# Altium project EL0258.PrjPcb
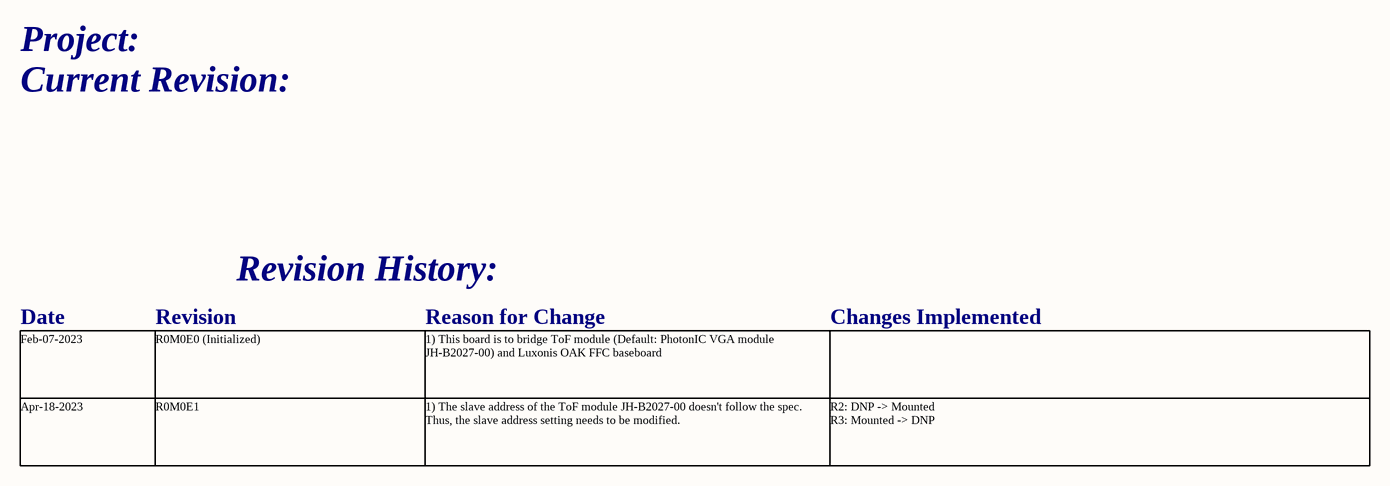
[diagram p0: 01_Project Information.SchDoc]
document_number: D0000999; drawn_by: Eason Lin; project_title: EL0258; revision: R0M0E1
3 sheets, 51 parts. Net scope: global (net labels, ports and power ports of the same name join across sheets).
Board file: EL0258.PcbDoc
Sheets:
  01_Project Information.SchDoc
  02_READ_ME.SchDoc
  03_TOF.SchDoc

## Sheet 01_Project Information.SchDoc: =project_title
size Tabloid; CompanyName: Luxonis Holding; DrawnBy: Eason Lin; Organization: Luxonis Holding; Address1: 1925 Harmony Park Drive; Address2: Westminster, CO; Address3: 80234; Address4: United States; DocumentNumber: D0000999; Revision: R0M0E1; SheetNumber: 1; SheetTotal: 3

### Notes on the sheet
- Project:
- Current Revision:
- Revision History:
- Date
- Revision
- Reason for Change
- Changes Implemented
- Feb-07-2023
- R0M0E0 (Initialized)
- 1) This board is to bridge ToF module (Default: PhotonIC VGA module JH-B2027-00) and Luxonis OAK FFC baseboard
- Apr-18-2023
- R0M0E1
- 1) The slave address of the ToF module JH-B2027-00 doesn't follow the spec. Thus, the slave address setting needs to be modified.
- R2: DNP -> Mounted
  R3: Mounted -> DNP
- Title
- Size:
- Date:
- Tabloid
- Number:
- Time:
- Revision:
- Sheet
- of
- Drawn by:

## Sheet 02_READ_ME.SchDoc: =project_title
size Tabloid; CompanyName: Luxonis Holding; DrawnBy: Eason Lin; Organization: Luxonis Holding; Address1: 1925 Harmony Park Drive; Address2: Westminster, CO; Address3: 80234; Address4: United States; DocumentNumber: D0000999; Revision: R0M0E1; SheetNumber: 1; SheetTotal: 3
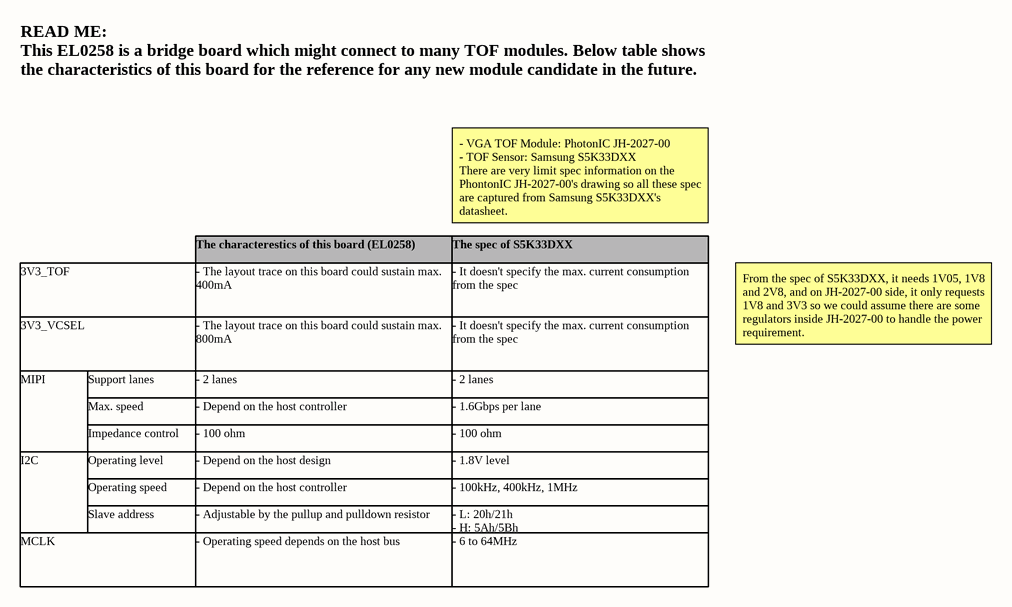
[diagram p1: 02_READ_ME.SchDoc]

### Notes on the sheet
- READ ME:
  This EL0258 is a bridge board which might connect to many TOF modules. Below table shows the characteristics of this board for the reference for any new module candidate in the future.
- - VGA TOF Module: PhotonIC JH-2027-00
  - TOF Sensor: Samsung S5K33DXX
  There are very limit spec information on the PhontonIC JH-2027-00's drawing so all these spec are captured from Samsung S5K33DXX's datasheet.
- 3V3_TOF
- - The layout trace on this board could sustain max. 400mA
- The characterestics of this board (EL0258)
- The spec of S5K33DXX
- - It doesn't specify the max. current consumption from the spec
- 3V3_VCSEL
- - The layout trace on this board could sustain max. 800mA
- From the spec of S5K33DXX, it needs 1V05, 1V8 and 2V8, and on JH-2027-00 side, it only requests 1V8 and 3V3 so we could assume there are some regulators inside JH-2027-00 to handle the power requirement.
- MIPI
- Support lanes
- Max. speed
- Impedance control
- - 2 lanes
- - Depend on the host controller
- - 100 ohm
- - 1.6Gbps per lane
- Operating level
- Operating speed
- - Depend on the host design
- - 1.8V level
- - 100kHz, 400kHz, 1MHz
- I2C
- MCLK
- Slave address
- - Adjustable by the pullup and pulldown resistor
- - Operating speed depends on the host bus
- - L: 20h/21h
  - H: 5Ah/5Bh
- - 6 to 64MHz
- Title
- Size:
- Date:
- Tabloid
- Number:
- Time:
- Revision:
- Sheet
- of
- Drawn by:

## Sheet 03_TOF.SchDoc: =project_title
size Tabloid; PageSetup: Record=PageOptions|CenterHorizontal=True|CenterVertical=True|PrintScale=0.71|XCorrection=1.00|YCorrection=1.00|PrintKind=0|BorderSize=5000000|LeftOffset=0|BottomOffset=0|Orientation=2|PaperLength=1000|PaperWidth=1000|Scale=100|PaperSource=7|PrintQuality=-4|MediaType=1|DitherType=10|PrintScaleMode=1|PaperKind=A4; CompanyName: Luxonis Holding; DrawnBy: Eason Lin; Organization: Luxonis Holding; Address1: 1925 Harmony Park Drive; Address2: Westminster, CO; Address3: 80234; Address4: United States; DocumentNumber: D0000999; Revision: R0M0E1; SheetNumber: 3; SheetTotal: 3
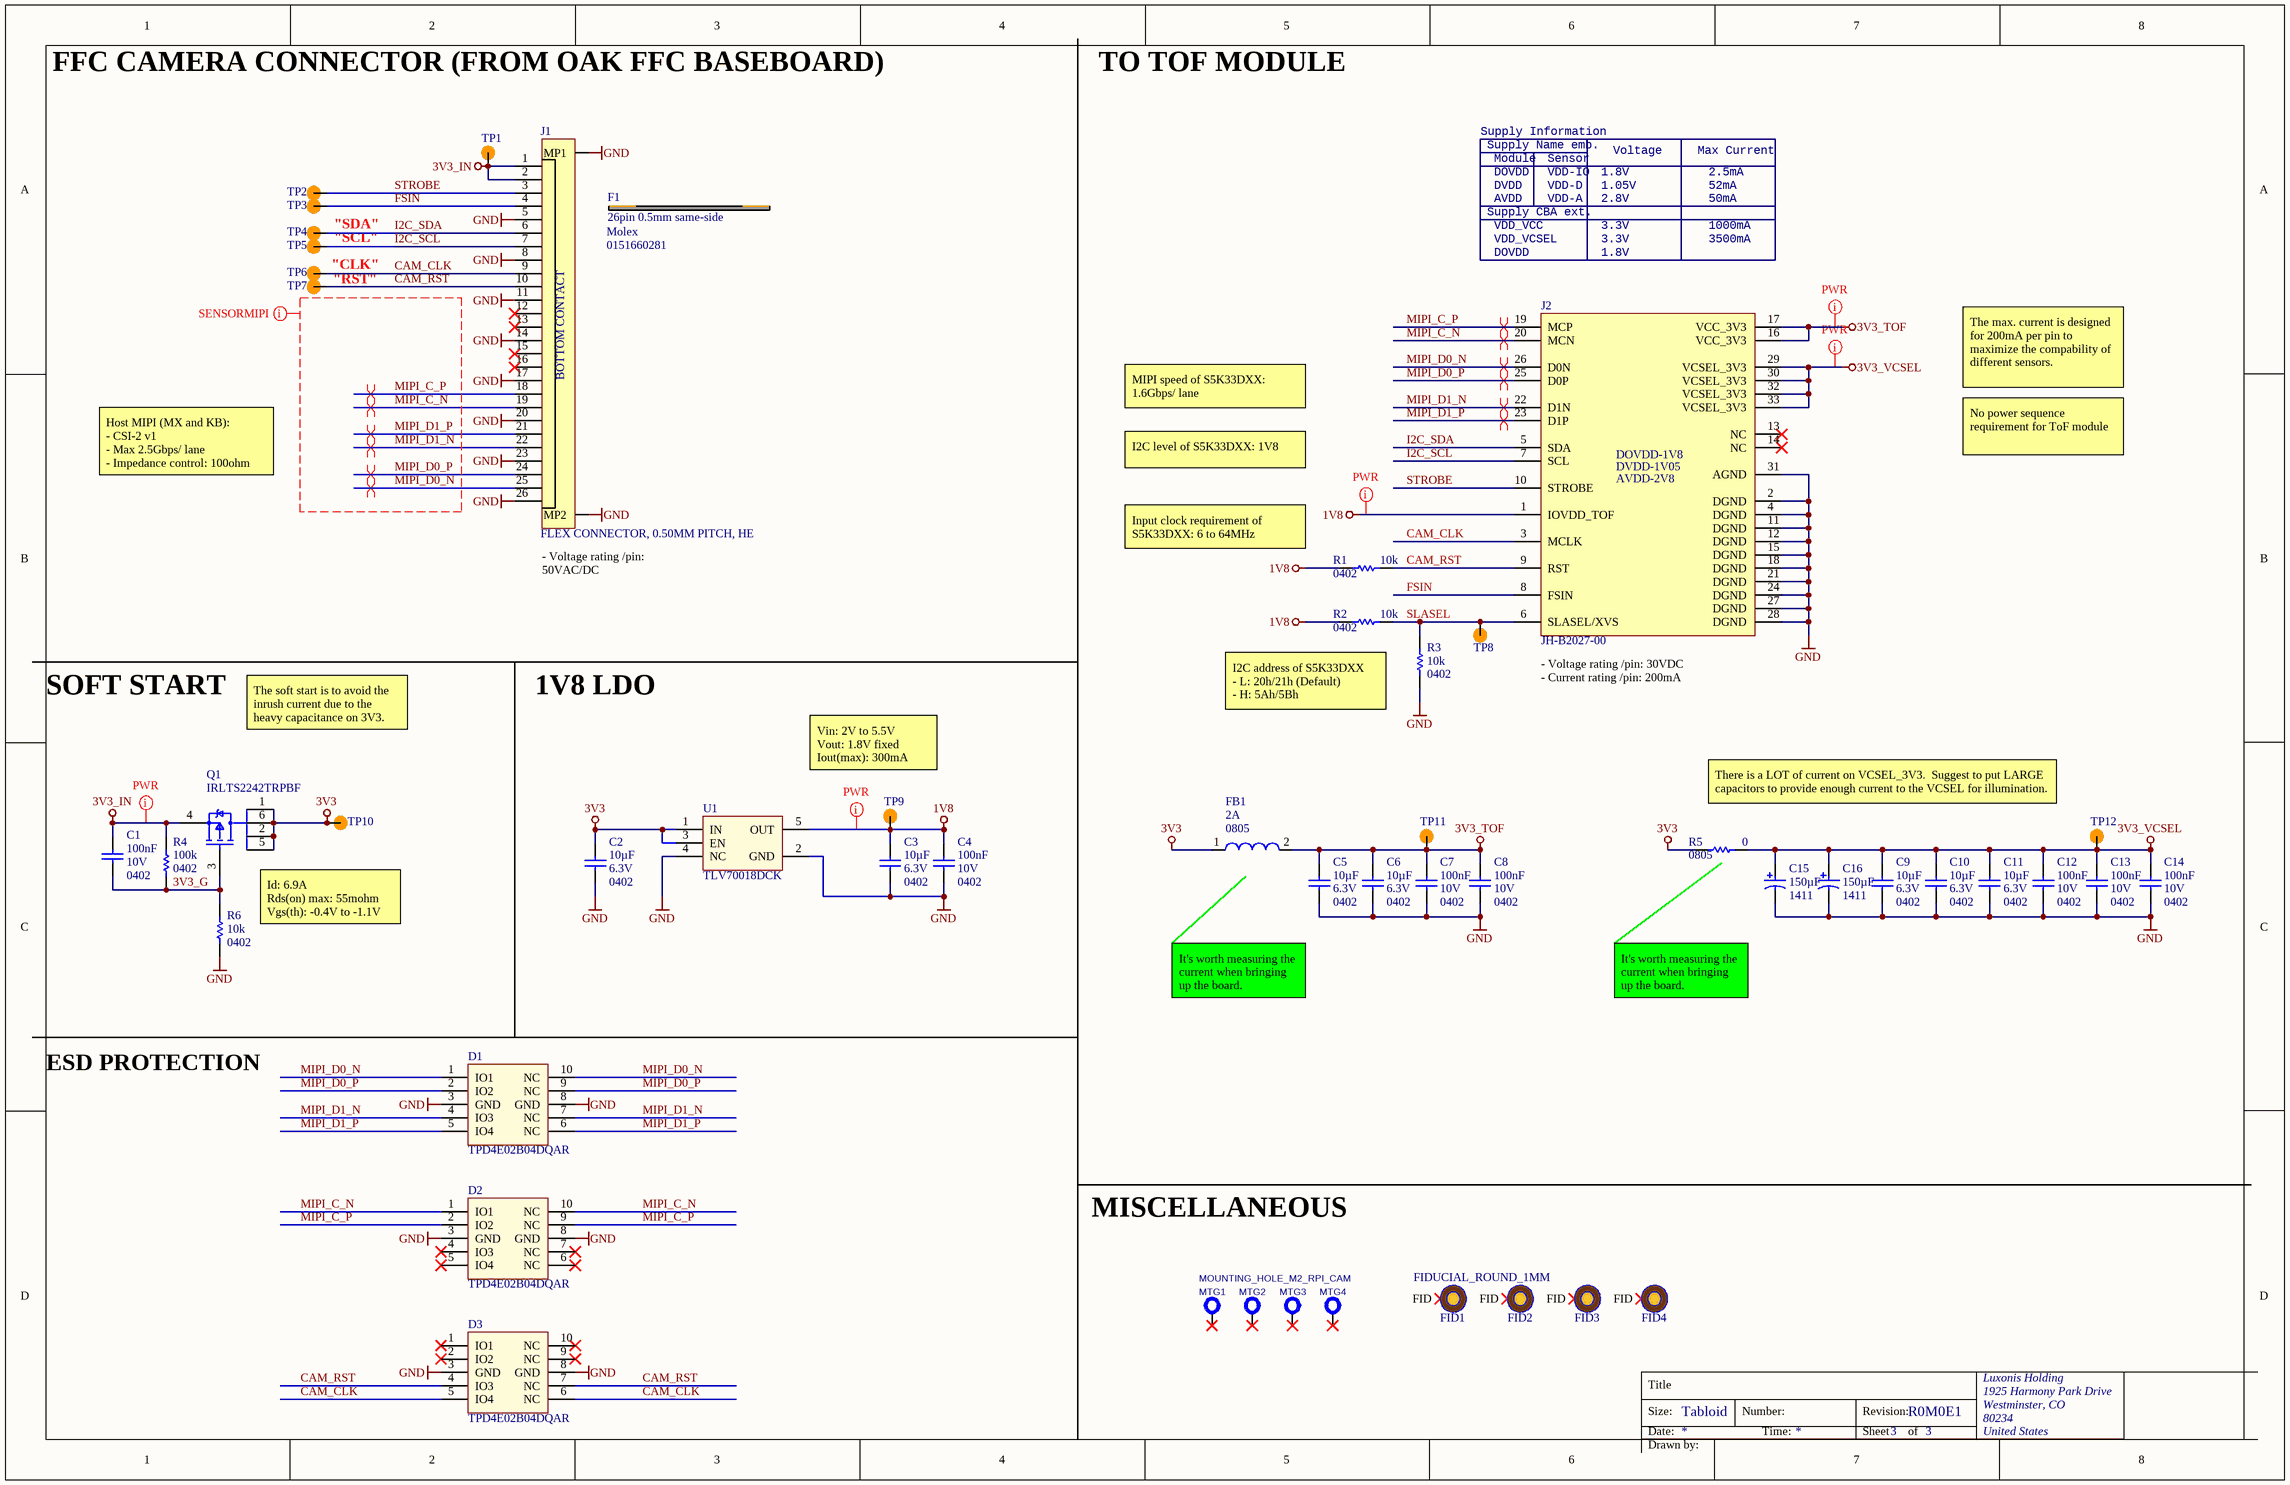
[diagram p2: 03_TOF.SchDoc]

### Parts
C1  value 100nF  Voltage Rating: 10V  Case/Package: 0402  [CAPC0402(1005)70_N]  (hidden comment: GRM155R71A104JA01D)
C2  value 10µF  Case/Package: 0402  Voltage Rating: 6.3V  [CAPC0402(1005)70_L]  (hidden comment: GRM155R60J106ME15D)
C3  value 10µF  Case/Package: 0402  Voltage Rating: 6.3V  [CAPC0402(1005)70_L]  (hidden comment: GRM155R60J106ME15D)
C4  value 100nF  Voltage Rating: 10V  Case/Package: 0402  [CAPC0402(1005)70_N]  (hidden comment: GRM155R71A104JA01D)
C5  value 10µF  Case/Package: 0402  Voltage Rating: 6.3V  [CAPC0402(1005)70_L]  (hidden comment: GRM155R60J106ME15D)
C6  value 10µF  Case/Package: 0402  Voltage Rating: 6.3V  [CAPC0402(1005)70_L]  (hidden comment: GRM155R60J106ME15D)
C7  value 100nF  Voltage Rating: 10V  Case/Package: 0402  [CAPC0402(1005)70_N]  (hidden comment: GRM155R71A104JA01D)
C8  value 100nF  Voltage Rating: 10V  Case/Package: 0402  [CAPC0402(1005)70_N]  (hidden comment: GRM155R71A104JA01D)
C9  value 10µF  Case/Package: 0402  Voltage Rating: 6.3V  [CAPC0402(1005)70_L]  (hidden comment: GRM155R60J106ME15D)
C10  value 10µF  Case/Package: 0402  Voltage Rating: 6.3V  [CAPC0402(1005)70_L]  (hidden comment: GRM155R60J106ME15D)
C11  value 10µF  Case/Package: 0402  Voltage Rating: 6.3V  [CAPC0402(1005)70_L]  (hidden comment: GRM155R60J106ME15D)
C12  value 100nF  Voltage Rating: 10V  Case/Package: 0402  [CAPC0402(1005)70_N]  (hidden comment: GRM155R71A104JA01D)
C13  value 100nF  Voltage Rating: 10V  Case/Package: 0402  [CAPC0402(1005)70_N]  (hidden comment: GRM155R71A104JA01D)
C14  value 100nF  Voltage Rating: 10V  Case/Package: 0402  [CAPC0402(1005)70_N]  (hidden comment: GRM155R71A104JA01D)
C15  value 150µF  Case/Package: 1411  [RESTL1210(3225)_L]  (hidden comment: TLJB157M010R0500)
C16  value 150µF  Case/Package: 1411  [RESTL1210(3225)_L]  (hidden comment: TLJB157M010R0500)
D1  TPD4E02B04DQAR  [TPD4E02B04DQAR]
D2  TPD4E02B04DQAR  [TPD4E02B04DQAR]
D3  TPD4E02B04DQAR  [TPD4E02B04DQAR]
F1  26pin 0.5mm same-side  Manufacturer 1: Molex  (mechanical)
FB1  Case/Package: 0805  Current Rating: 2A  [2508056017Y2]  (hidden comment: 2508056017Y2)
FID1  FIDUCIAL_ROUND_1MM  [FIDUCIAL_ROUND_1MM]  (no BOM)
FID2  FIDUCIAL_ROUND_1MM  [FIDUCIAL_ROUND_1MM]  (value not drawn)  (no BOM)
FID3  FIDUCIAL_ROUND_1MM  [FIDUCIAL_ROUND_1MM]  (value not drawn)  (no BOM)
FID4  FIDUCIAL_ROUND_1MM  [FIDUCIAL_ROUND_1MM]  (value not drawn)  (no BOM)
J1  FLEX CONNECTOR, 0.50MM PITCH, HE  [F32R-1A7H1-11026]
J2  JH-B2027-00  [PCBComponent_1]
MTG1  MOUNTING_HOLE_M2_RPI_CAM  [MOUNTING_HOLE_M2_RPI_CAM]  (no BOM)
MTG2  MOUNTING_HOLE_M2_RPI_CAM  [MOUNTING_HOLE_M2_RPI_CAM]  (value not drawn)  (no BOM)
MTG3  MOUNTING_HOLE_M2_RPI_CAM  [MOUNTING_HOLE_M2_RPI_CAM]  (value not drawn)  (no BOM)
MTG4  MOUNTING_HOLE_M2_RPI_CAM  [MOUNTING_HOLE_M2_RPI_CAM]  (value not drawn)  (no BOM)
Q1  IRLTS2242TRPBF  [TSOP-6-MFG]
R1  value 10k  Case/Package: 0402  [RESC0402(1005)_N]  (hidden comment: RC0402FR-1310KL)
R2  value 10k  Case/Package: 0402  [RESC0402(1005)_N]  (hidden comment: RC0402FR-1310KL)
R3  value 10k  Case/Package: 0402  [RESC0402(1005)_N]  (hidden comment: RC0402FR-1310KL)
R4  value 100k  Case/Package: 0402  [RESC0402(1005)_L]  (hidden comment: RC0402FR-07100KL)
R5  value 0  Case/Package: 0805  [RESC0805(2012)_L]  (hidden comment: CRCW08050000Z0EA)
R6  value 10k  Case/Package: 0402  [RESC0402(1005)_N]  (hidden comment: RC0402FR-1310KL)
TP1  TEST_POINT  [TP075_150_NS]  (value not drawn)  (no BOM)
TP2  TEST_POINT  [TP075_150_NS]  (value not drawn)  (no BOM)
TP3  TEST_POINT  [TP075_150_NS]  (value not drawn)  (no BOM)
TP4  TEST_POINT  [TP075_150_NS]  (value not drawn)  (no BOM)
TP5  TEST_POINT  [TP075_150_NS]  (value not drawn)  (no BOM)
TP6  TEST_POINT  [TP075_150_NS]  (value not drawn)  (no BOM)
TP7  TEST_POINT  [TP075_150_NS]  (value not drawn)  (no BOM)
TP8  TEST_POINT  [TP075_150_NS]  (value not drawn)  (no BOM)
TP9  TEST_POINT  [TP075_150_NS]  (value not drawn)  (no BOM)
TP10  TEST_POINT  [TP075_150_NS]  (value not drawn)  (no BOM)
TP11  TEST_POINT  [TP075_150_NS]  (value not drawn)  (no BOM)
TP12  TEST_POINT  [TP075_150_NS]  (value not drawn)  (no BOM)
U1  TLV70018DCK  [TLV70018DCK]

### Nets
1V8: C3.2 C4.2 J2.1(IOVDD_TOF) R1.1 R2.1 TP9.1 U1.5(OUT)
3V3: C2.2 FB1.1 Q1.1(D) Q1.2(D) Q1.5(D) Q1.6(D) R5.1 TP10.1 U1.1(IN) U1.3(EN)
3V3_IN: C1.2 J1.1 J1.2 Q1.4(S) R4.2 TP1.1
3V3_TOF: C5.2 C6.2 C7.2 C8.2 FB1.2 J2.16(VCC_3V3) J2.17(VCC_3V3) TP11.1
3V3_VCSEL: C9.2 C10.2 C11.2 C12.2 C13.2 C14.2 C15.1 C16.1 J2.29(VCSEL_3V3) J2.30(VCSEL_3V3) J2.32(VCSEL_3V3) J2.33(VCSEL_3V3) R5.2 TP12.1
GND: C2.1 C3.1 C4.1 C5.1 C6.1 C7.1 C8.1 C9.1 C10.1 C11.1 C12.1 C13.1 C14.1 C15.2 C16.2 D1.3(GND) D1.8(GND) D2.3(GND) D2.8(GND) D3.3(GND) D3.8(GND) J1.5 J1.8 J1.11 J1.14 J1.17 J1.20 J1.23 J1.26 J1.MP1 J1.MP2 J2.2(DGND) J2.4(DGND) J2.11(DGND) J2.12(DGND) J2.15(DGND) J2.18(DGND) J2.21(DGND) J2.24(DGND) J2.27(DGND) J2.28(DGND) J2.31(AGND) R3.1 R6.1 U1.2(GND) U1.4(NC)
3V3_G: C1.1 Q1.3(G) R4.1 R6.2
CAM_CLK: D3.5(IO4) D3.6(NC) J1.9 J2.3(MCLK) TP6.1
CAM_RST: D3.4(IO3) D3.7(NC) J1.10 J2.9(RST) R1.2 TP7.1
FSIN: J1.4 J2.8(FSIN) TP3.1
I2C_SCL: J1.7 J2.7(SCL) TP5.1
I2C_SDA: J1.6 J2.5(SDA) TP4.1
MIPI_C_N: D2.1(IO1) D2.10(NC) J1.19 J2.20(MCN)
MIPI_C_P: D2.2(IO2) D2.9(NC) J1.18 J2.19(MCP)
MIPI_D0_N: D1.1(IO1) D1.10(NC) J1.25 J2.26(D0N)
MIPI_D0_P: D1.2(IO2) D1.9(NC) J1.24 J2.25(D0P)
MIPI_D1_N: D1.4(IO3) D1.7(NC) J1.22 J2.22(D1N)
MIPI_D1_P: D1.5(IO4) D1.6(NC) J1.21 J2.23(D1P)
SLASEL: J2.6(SLASEL/XVS) R2.2 R3.2 TP8.1
STROBE: J1.3 J2.10(STROBE) TP2.1

Not connected (* = marked no-connect by the designer): D2 4(IO3)* 5(IO4)* 6(NC)* 7(NC)*; D3 1(IO1)* 2(IO2)* 9(NC)* 10(NC)*; FID1 FID*; FID2 FID*; FID3 FID*; FID4 FID*; J1 12* 13* 15* 16*; J2 13(NC)* 14(NC)*; MTG1 1*; MTG2 1*; MTG3 1*; MTG4 1*

### Layout directives
net class SENSORMIPI: MIPI_C_N, MIPI_C_P, MIPI_D0_N, MIPI_D0_P, MIPI_D1_N, MIPI_D1_P
differential pair; differential pair class 100ohm: MIPI_C_N, MIPI_C_P, MIPI_D0_N, MIPI_D0_P, MIPI_D1_N, MIPI_D1_P
net class Power; Max. current: 200mA per pin: 1V8, 3V3_TOF, 3V3_VCSEL
net class Power; Max. current: 1A: 3V3_IN
net class Power; Max. current: 300mA: 1V8

### Notes on the sheet
- FFC CAMERA CONNECTOR (FROM OAK FFC BASEBOARD)
- TO TOF MODULE
- Supply Information
- Supply Name emb.
- Module
- Sensor
- Voltage
- Max Current
- "SDA"
- Supply CBA ext.
- AVDD
- DOVDD
- DVDD
- VDD_VCC
- VDD-A
- VDD-IO
- VDD-D
- 2.8V
- 1.8V
- 1.05V
- 3.3V
- 50mA
- 2.5mA
- 52mA
- 1000mA
- "CLK"
- "RST"
- "SCL"
- VDD_VCSEL
- 3500mA
- MIPI speed of S5K33DXX: 1.6Gbps/ lane
- The max. current is designed for 200mA per pin to maximize the compability of different sensors.
- Host MIPI (MX and KB):
  - CSI-2 v1
  - Max 2.5Gbps/ lane
  - Impedance control: 100ohm
- I2C level of S5K33DXX: 1V8
- No power sequence requirement for ToF module
- (near J1) - Voltage rating /pin: 50VAC/DC
  - Current rating /pin: 500mA
- (near R1) Input clock requirement of S5K33DXX: 6 to 64MHz
- SOFT START
- 1V8 LDO
- I2C address of S5K33DXX
  - L: 20h/21h (Default)
  - H: 5Ah/5Bh
- (near J2) - Voltage rating /pin: 30VDC
  - Current rating /pin: 200mA
- The soft start is to avoid the inrush current due to the heavy capacitance on 3V3.
- Vin: 2V to 5.5V
  Vout: 1.8V fixed
  Iout(max): 300mA
- There is a LOT of current on VCSEL_3V3.  Suggest to put LARGE capacitors to provide enough current to the VCSEL for illumination.
- Id: 6.9A
  Rds(on) max: 55mohm
  Vgs(th): -0.4V to -1.1V
- It's worth measuring the current when bringing up the board.
- ESD PROTECTION
- MISCELLANEOUS
- Title
- Size:
- Date:
- Tabloid
- Number:
- Time:
- Revision:
- Sheet
- of
- Drawn by:
- (in symbol CMP-002-00132-2) DOVDD-1V8; DVDD-1V05; AVDD-2V8
- (in symbol F32R-1A7H1-11026) BOTTOM CONTACT

### Library data of the parts
C1 C4 C7 C8 C12-C14 = CMP-108-000015-5: CAP CER 0.1UF 10V X7R 0402 5%; Manufacturer 1: Murata; Dielectric: X7R; Tolerance: 5%; Min Operating Temperature: -55°C; Mounting Technology: SMT; Max Operating Temperature: 125°C; Depth: 0.5mm; Height: 0.5mm; ComponentLink2Description: https://datasheet.ciiva.com/11618/c02e-11618821.pdf?src-supplier=Avnet; Length: 1mm; Width: 0.02inch; ComponentLink1URL: https://datasheet.ciiva.com/5411/product-5411135.pdf?src-supplier=Mouser; Design Item ID: GRM155R71A104JA01D; ComponentLink1Description: https://datasheet.ciiva.com/5411/product-5411135.pdf?src-supplier=Mouser; Manufacturer Part Number 1: GRM155R71A104JA01D; ComponentLink2URL: https://datasheet.ciiva.com/11618/c02e-11618821.pdf?src-supplier=Avnet
C2 C3 C5 C6 C9-C11 = CMP-004-000009-5: CAP CER 10UF 6.3V X5R 0402 20%; Manufacturer 1: Murata; Manufacturer Part Number 1: GRM155R60J106ME15D; Min Operating Temperature: -55°C; Max Operating Temperature: 85°C; Dielectric: X5R; Length: 0.039inch; Width: 0.02inch; ComponentLink1URL: https://www.murata.com/~/media/webrenewal/support/library/catalog/products/capacitor/mlcc/c02e.ashx?la=en-us&src-supplier=Digi-Key; ComponentLink1Description: https://www.murata.com/~/media/webrenewal/support/library/catalog/products/capacitor/mlcc/c02e.ashx?la=en-us&src-supplier=Digi-Key; Tolerance: 20%; Design Item ID: GRM155R60J106ME15D; Mounting Technology: SMT
C15 C16 = CMP-050-000000-4: CAP TAL 150UF 10V 20%; Manufacturer 1: Kyocera AVX; Capacitor Type: Tantalum; Polarity: Polarized; ComponentLink5Description: https://datasheet.ciiva.com/46385/1910903-46385237.pdf?src-supplier=Element14; Manufacturer Part Number 1: TLJB157M010R0500; Min Operating Temperature: -55°C; ComponentLink6Description: https://datasheet.ciiva.com/28515/tlj-28515528.pdf?src-supplier=Element14; ComponentLink4URL: https://datasheet.ciiva.com/264/tlj-264788.pdf?src-supplier=Digi-Key; ComponentLink5URL: https://datasheet.ciiva.com/46385/1910903-46385237.pdf?src-supplier=Element14; Length: 3.5mm; ComponentLink2URL: https://datasheet.ciiva.com/264/tlj-264786.pdf?src-supplier=Digi-Key; ComponentLink10URL: https://datasheet.ciiva.com/7773/1533257-7773834.pdf?src-supplier=Element14; ComponentLink11URL: https://datasheet.ciiva.com/11229/tlj-11229389.pdf?src-supplier=Avnet; Design Item ID: TLJB157M010R0500; ComponentLink10Description: https://datasheet.ciiva.com/7773/1533257-7773834.pdf?src-supplier=Element14; ComponentLink11Description: https://datasheet.ciiva.com/11229/tlj-11229389.pdf?src-supplier=Avnet; ComponentLink12URL: https://datasheet.ciiva.com/17339/tlj-17339422.pdf?src-supplier=Avnet+Europe; Mounting Technology: SMT; ComponentLink3URL: https://datasheet.ciiva.com/264/tlj-264787.pdf?src-supplier=Digi-Key; ComponentLink1Description: https://datasheet.ciiva.com:443/pdfs/VipMasterIC/IC/AVXC/AVXC-S-A0008508048/AVXC-S-A0008508048-1.pdf?src-supplier=IHS+Markit; ComponentLink12Description: https://datasheet.ciiva.com/17339/tlj-17339422.pdf?src-supplier=Avnet+Europe; ComponentLink7Description: https://datasheet.ciiva.com/7773/1533257-7773833.pdf?src-supplier=Element14; ComponentLink3Description: https://datasheet.ciiva.com/264/tlj-264787.pdf?src-supplier=Digi-Key; Max Operating Temperature: 125°C; Voltage Rating: 10V; ComponentLink8Description: https://datasheet.ciiva.com/14593/70001364-14593673.pdf?src-supplier=Allied+Electronics; Width: 2.8mm; ComponentLink2Description: https://datasheet.ciiva.com/264/tlj-264786.pdf?src-supplier=Digi-Key; ComponentLink7URL: https://datasheet.ciiva.com/7773/1533257-7773833.pdf?src-supplier=Element14; ComponentLink9URL: https://datasheet.ciiva.com/14606/70001364-14606409.pdf?src-supplier=Allied+Electronics; ComponentLink6URL: https://datasheet.ciiva.com/28515/tlj-28515528.pdf?src-supplier=Element14; ComponentLink4Description: https://datasheet.ciiva.com/264/tlj-264788.pdf?src-supplier=Digi-Key; ComponentLink9Description: https://datasheet.ciiva.com/14606/70001364-14606409.pdf?src-supplier=Allied+Electronics; ComponentLink8URL: https://datasheet.ciiva.com/14593/70001364-14593673.pdf?src-supplier=Allied+Electronics; ComponentLink1URL: https://datasheet.ciiva.com:443/pdfs/VipMasterIC/IC/AVXC/AVXC-S-A0008508048/AVXC-S-A0008508048-1.pdf?src-supplier=IHS+Markit; Height: 1.9mm; Tolerance: 20%
D1-D3 = CMP-111-000006-2: TVS DIODE 3.6V 8.8V 10USON 8.8V (Typ) Clamp 5A (8/20µs) Ipp Tvs Diode Surface Mount 10-USON (2.5x1); Manufacturer 1: Texas Instruments; Power Line Protection: No; Number of Bidirectional Channels: 4; Interface: USB,HDMI; Peak Pulse Power: 17W; Min Breakdown Voltage: 5.5V; Clamping Voltage: 8.8V; Peak Pulse Current: 5A; Max Operating Temperature: 125°C; ComponentLink1URL: http://www.ti.com/general/docs/lit/getliterature.tsp?genericPartNumber=TPD4E02B04&amp;&amp;fileType=pdf&src-supplier=Element14; ComponentLink3Description: http://www.ti.com/lit/ds/symlink/tpd4e02b04.pdf?src-supplier=Newark; Min Operating Temperature: -40°C; Design Item ID: TPD4E02B04DQAR; Stock 1: 25615; ComponentLink1Description: http://www.ti.com/general/docs/lit/getliterature.tsp?genericPartNumber=TPD4E02B04&amp;&amp;fileType=pdf&src-supplier=Element14; Lead Free: Lead Free; Source: BW2098POE_1.SCHLIB; ComponentLink3URL: http://www.ti.com/lit/ds/symlink/tpd4e02b04.pdf?src-supplier=Newark; Packaging: Cut Tape; Reverse Standoff Voltage: 3.6V; Operating Supply Voltage: 3.6V; Pricing 1: 1=0.69000, 10=0.60800, 100=0.46650, 500=0.36874, 1000=0.29499 (USD); Mount: Surface Mount; ComponentLink2Description: http://www.ti.com/lit/ds/symlink/tpd4e02b04.pdf?src-supplier=Farnell; Number of Channels: 4; ComponentLink4Description: http://www.ti.com/lit/ds/symlink/tpd4e02b04.pdf?src-supplier=Digi-Key; REACH SVHC: No SVHC; RoHS: Yes; ComponentLink2URL: http://www.ti.com/lit/ds/symlink/tpd4e02b04.pdf?src-supplier=Farnell; Number of Pins: 10; ComponentLink4URL: http://www.ti.com/lit/ds/symlink/tpd4e02b04.pdf?src-supplier=Digi-Key; Composition: Zener; Manufacturer Part Number 1: TPD4E02B04DQAR
F1 = 0151660281: CABLE FFC 26POS 0.50MM 6"; Number of Conductors: 26; Wire/Cable Type: Flat Flex; Pitch: 0.02inch; Supplier 1: Digi-Key; Manufacturer Part Number 1: 0151660281; Stock 1: 118; Pricing 1: 1=2.21000, 10=2.01000, 25=1.88680, 50=1.80460, 100=1.72260, 250=1.55856, 500=1.43552, 1000=1.23045, 2500=1.14842 (USD); RoHS: Yes; Number of Pins: 26; Packaging: Bulk; Package Quantity: 1000; Length: 6inch; Cable Pitch: 0.5mm; Radiation Hardening: No; ComponentLink1URL: https://datasheet.ciiva.com/10989/0151660281-cable-10989152.pdf?src-supplier=Avnet; ComponentLink1Description: https://datasheet.ciiva.com/10989/0151660281-cable-10989152.pdf?src-supplier=Avnet; ComponentLink2URL: https://datasheet.ciiva.com/2944/151660051-sd-2944673.pdf?src-supplier=Digi-Key; ComponentLink2Description: https://datasheet.ciiva.com/2944/151660051-sd-2944673.pdf?src-supplier=Digi-Key; Supplier 2: Mouser; Supplier Part Number 1: WM11334-ND; Supplier Part Number 2: 538-15166-0281
FB1 = CMP-082-000000-2: FERRITE BEAD, 0.1OHM, 2A, 0805, 600R/100MHz; Manufacturer 1: Fair-Rite; Tolerance: 25%; Manufacturer Part Number 1: 2508056017Y2
FID1-FID4 = FIDUCIAL: Fiducial with various available footprints
J1 = F32R-1A7H1-11026: 26 Position FFC, FPC Connector Contacts, Bottom 0.020" (0.50mm) Surface Mount, Right Angle; Manufacturer 1: Amphenol ICC (FCI); Number of Positions: 26; Voltage Rating: 50V; Current Rating: 500mA; Pitch: 0.02inch; Supplier 1: Digi-Key; Manufacturer Part Number 1: F32R-1A7H1-11026; RoHS: Yes; Category: Connectors; Pricing 1: 1=0.77, 10=0.721, 100=0.5529, 500=0.4808 (USD); Mount: Surface Mount; Contact Plating: Tin; Contact Material: Bronze; Min Operating Temperature: -40°C; Max Operating Temperature: 105°C; Packaging: Tape and Reel; Termination: Solder; Flammability Rating: UL94 V-0; ComponentLink1URL: https://cdn.amphenol-icc.com/media/wysiwyg/files/drawing/f32r-f32j.pdf; ComponentLink1Description: https://cdn.amphenol-icc.com/media/wysiwyg/files/drawing/f32r-f32j.pdf; Stock 1: 1709; Supplier Part Number 1: 609-F32R-1A7H1-11026CT-ND
J2 = CMP-002-00132-2: FFC/FPC Connector, 33 Contact(s), 1 Row(s), Female, Right Angle, Surface Mount Terminal; Manufacturer 1: Hirose; Manufacturer Part Number 1: FH26W-33S-0.3SHW(60); ComponentLink1URL: https://datasheet.ciiva.com:443/pdfs/VipMasterIC/IC/HIRO/HIRO-S-A0007913874/HIRO-S-A0008593114-1.pdf?src-supplier=IHS+Markit; Design Item ID: AC_PY004-IMX378_CON; Category: FFC / FPC; ComponentLink2Description: https://www.hirose.com/product/en/download_file/key_name/FH26/category/Catalog/doc_file_id/49355/?file_category_id=4&item_id=298&is_series=1&src-supplier=Digi-Key; Pricing 1: 1=1,78000, 10=1,61700, 25=1,51800, 50=1,45200, 100=1,38600, 250=1,25400, 500=1,15500, 1000=0,99000, 2500=0,92400 (USD); Source: LuxonisMaster.SchLib; ComponentLink3URL: https://www.hirose.com/product/download/?distributor=digikey&amp;type=2d&amp;lang=en&amp;num=FH26W-13S-0.3SHW(60)&src-supplier=Digi-Key; ComponentLink1Description: https://datasheet.ciiva.com:443/pdfs/VipMasterIC/IC/HIRO/HIRO-S-A0007913874/HIRO-S-A0008593114-1.pdf?src-supplier=IHS+Markit; Pins: 33; Stock 1: 627; ComponentLink2URL: https://www.hirose.com/product/en/download_file/key_name/FH26/category/Catalog/doc_file_id/49355/?file_category_id=4&item_id=298&is_series=1&src-supplier=Digi-Key; ComponentLink3Description: https://www.hirose.com/product/download/?distributor=digikey&amp;type=2d&amp;lang=en&amp;num=FH26W-13S-0.3SHW(60)&src-supplier=Digi-Key; RoHS: Yes
MTG1-MTG4 = MP_Mounting-Holes: =CurrentFootprint; B - Value: Not a Part; A - Level: 0
Q1 = CMP-016-000020-2: MOSFET P-CH 20V 6.9A 6TSOP; Manufacturer 1: Infineon; Max Drain to Source Voltage: -20V; Design Item ID: IRLTS2242TRPBF; Manufacturer Part Number 1: IRLTS2242TRPBF; Case/Package: TSOP; Continuous Drain Current: 6.9A
R1-R3 R6 = CMP-115-000004-8: RES SMD 10K OHM 1% 1/16W 0402; Manufacturer 1: Yageo; Power Rating: 62.5mW; Temperature Coefficient: 100ppm/°C; Voltage Rating: 50V; Min Operating Temperature: -55°C; Max Operating Temperature: 155°C; Design Item ID: RC0402FR-1310KL; Tolerance: 1%; Manufacturer Part Number 1: RC0402FR-1310KL
R4 = CMP-013-000035-8: RES SMD 100K OHM 1% 1/16W 0402; Manufacturer 1: Yageo; Power Rating: 63mW; Voltage Rating: 50V; Tolerance: 1%; Min Operating Temperature: -55°C; Max Operating Temperature: 155°C; Design Item ID: RC0402FR-07100KL; Manufacturer Part Number 1: RC0402FR-07100KL
R5 = CMP-013-000034-9: RES SMD 0 OHM 1% 1/8W 0805; Manufacturer 1: Vishay; Power Rating: 125mW; Manufacturer Part Number 1: CRCW08050000Z0EA; Max Operating Temperature: 155°C; Min Operating Temperature: -55°C; Design Item ID: CRCW08050000Z0EA
TP1-TP12 = CMP-015-000000-2: Manufacturer Part Number 1: /; Source: LuxonisMaster.SchLib; Design Item ID: TEST_POINT
U1 = CMP-113-000003-2: IC REG LINEAR 1.8V 200MA SC70-5 Linear Voltage Regulator IC  1 Output  200mA SC-70-5; Manufacturer 1: Texas Instruments; Manufacturer Part Number 1: TLV70018DCKR; Max Supply Voltage: 5.5V; Min Supply Voltage: 2V; Min Operating Temperature: -40°C; Pins: 5; Max Output Voltage: 1.8V; Max Operating Temperature: 125°C; Case/Package: SC; Max Output Current: 200mA; Min Output Voltage: 1.8V

## Assembly variants
PhotonIC_VGA_TOF_JH-2027-00: not fitted R3; alternate parts C1 -> CMP-108-000015-5, C4 -> CMP-108-000015-5, C7 -> CMP-108-000015-5